# Altium schematic sheet [2] MUX.SchDoc
size A4
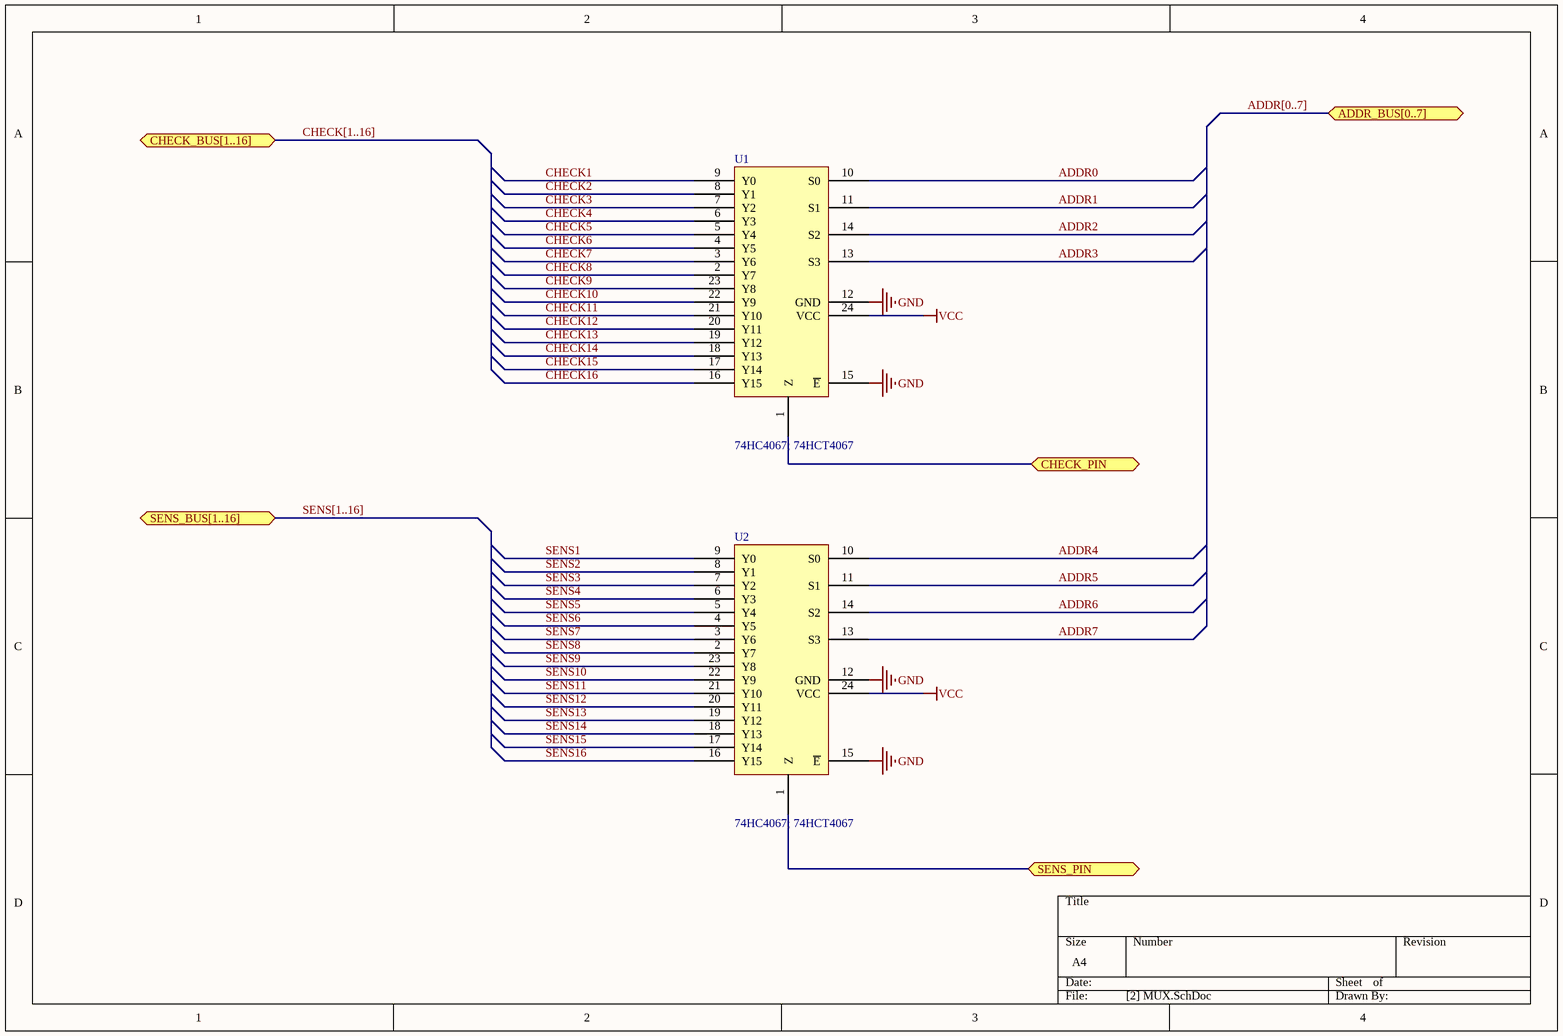
[diagram p0: [2] MUX.SchDoc]

## Parts
U1  74HC4067; 74HCT4067  [SO24]
U2  74HC4067; 74HCT4067  [SO24]

## Ports
ADDR_BUS[0..7], CHECK_BUS[1..16], CHECK_PIN, SENS_BUS[1..16], SENS_PIN

## Nets
GND: U1.12(GND) U1.15(~{E}) U2.12(GND) U2.15(~{E})
VCC: U1.24(VCC) U2.24(VCC)
ADDR0: U1.10(S0)
ADDR1: U1.11(S1)
ADDR2: U1.14(S2)
ADDR3: U1.13(S3)
ADDR4: U2.10(S0)
ADDR5: U2.11(S1)
ADDR6: U2.14(S2)
ADDR7: U2.13(S3)
CHECK1: U1.9(Y0)
CHECK2: U1.8(Y1)
CHECK3: U1.7(Y2)
CHECK4: U1.6(Y3)
CHECK5: U1.5(Y4)
CHECK6: U1.4(Y5)
CHECK7: U1.3(Y6)
CHECK8: U1.2(Y7)
CHECK9: U1.23(Y8)
CHECK10: U1.22(Y9)
CHECK11: U1.21(Y10)
CHECK12: U1.20(Y11)
CHECK13: U1.19(Y12)
CHECK14: U1.18(Y13)
CHECK15: U1.17(Y14)
CHECK16: U1.16(Y15)
CHECK_PIN: U1.1(Z) ; port CHECK_PIN
SENS1: U2.9(Y0)
SENS2: U2.8(Y1)
SENS3: U2.7(Y2)
SENS4: U2.6(Y3)
SENS5: U2.5(Y4)
SENS6: U2.4(Y5)
SENS7: U2.3(Y6)
SENS8: U2.2(Y7)
SENS9: U2.23(Y8)
SENS10: U2.22(Y9)
SENS11: U2.21(Y10)
SENS12: U2.20(Y11)
SENS13: U2.19(Y12)
SENS14: U2.18(Y13)
SENS15: U2.17(Y14)
SENS16: U2.16(Y15)
SENS_PIN: U2.1(Z) ; port SENS_PIN

## Buses and harness runs
bus ADDR[0..7] = port ADDR_BUS[0..7]
bus CHECK[1..16] = port CHECK_BUS[1..16]
bus SENS[1..16] = port SENS_BUS[1..16]

## Library data of the parts
U1 U2 = 74HC4067; 74HCT4067: 16-channel analog multiplexer/demultiplexer